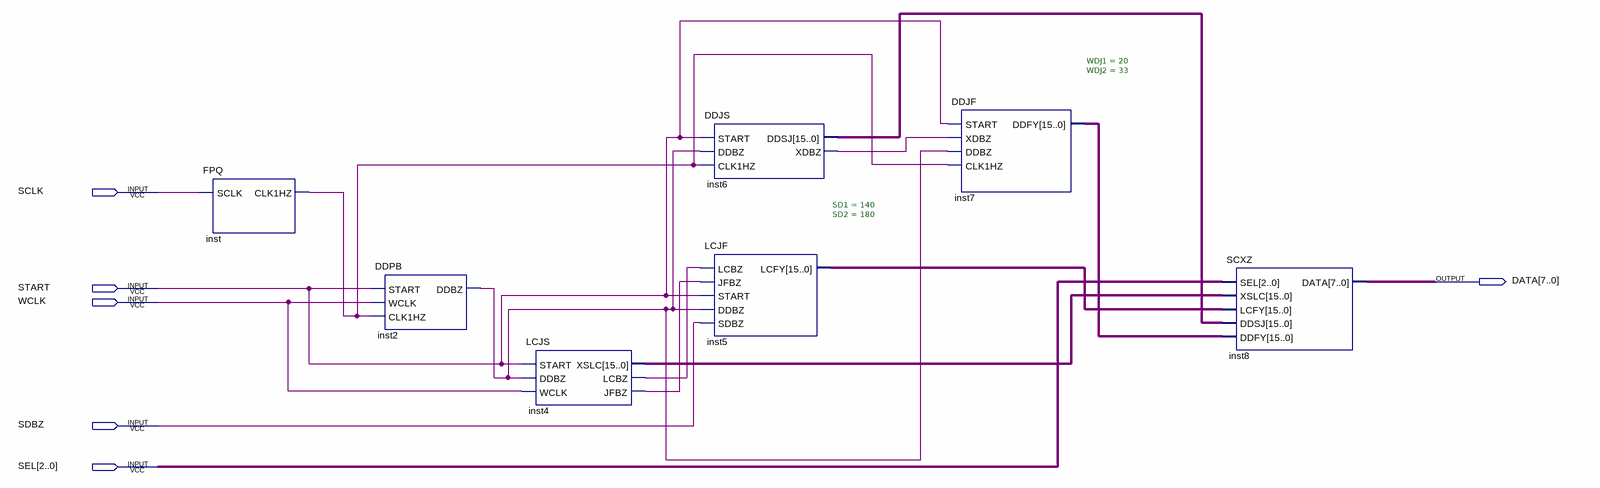
[diagram p0: schematic sheet]
// Quartus schematic Block1.bdf as structural Verilog: 7 symbols, 6 pins
module Block1 (
  input  SCLK,
  input  START,
  input  WCLK,
  input  SDBZ,
  input  [2:0] SEL,
  output [7:0] DATA
);

  wire inst2_ddbz, inst4_jfbz, inst4_lcbz, inst6_xdbz, inst_clk1hz;
  wire [15:0] inst4_xslc, inst5_lcfy, inst6_ddsj, inst7_ddfy;

  FPQ inst (.SCLK(SCLK), .CLK1HZ(inst_clk1hz));
  DDPB inst2 (.START(START), .WCLK(WCLK), .CLK1HZ(inst_clk1hz), .DDBZ(inst2_ddbz));
  LCJS inst4 (.START(START), .DDBZ(inst2_ddbz), .WCLK(WCLK), .XSLC(inst4_xslc), .LCBZ(inst4_lcbz), .JFBZ(inst4_jfbz));
  DDJS inst6 (.START(START), .DDBZ(inst2_ddbz), .CLK1HZ(inst_clk1hz), .DDSJ(inst6_ddsj), .XDBZ(inst6_xdbz));
  LCJF #(.SD1(140), .SD2(180)) inst5 (
    .LCBZ(inst4_lcbz), .JFBZ(inst4_jfbz), .START(START), .DDBZ(inst2_ddbz), .SDBZ(SDBZ), .LCFY(inst5_lcfy));
  DDJF #(.WDJ1(20), .WDJ2(33)) inst7 (
    .START(START), .XDBZ(inst6_xdbz), .DDBZ(inst2_ddbz), .CLK1HZ(inst_clk1hz), .DDFY(inst7_ddfy));
  SCXZ inst8 (.SEL(SEL), .XSLC(inst4_xslc), .LCFY(inst5_lcfy), .DDSJ(inst6_ddsj), .DDFY(inst7_ddfy), .DATA(DATA));
endmodule
